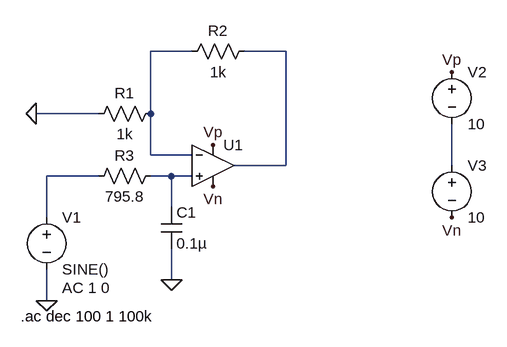
[diagram p0: schematic LPF Using 2KHz CutOFF.asc]
LPF Using 2KHz CutOFF.asc, the LTspice schematic file:
Version 4
SHEET 1 880 680
WIRE 144 -48 80 -48
WIRE 288 -48 224 -48
WIRE 0 48 -96 48
WIRE 80 48 80 -48
WIRE 80 112 80 48
WIRE 144 112 80 112
WIRE 288 128 288 -48
WIRE 288 128 208 128
WIRE 544 128 544 64
WIRE 0 144 -80 144
WIRE 112 144 80 144
WIRE 144 144 112 144
WIRE 112 192 112 144
WIRE -80 208 -80 144
WIRE 112 304 112 256
WIRE -80 336 -80 288
FLAG -80 336 0
FLAG -96 48 0
FLAG 112 304 0
FLAG 544 -16 Vp
FLAG 176 96 Vp
FLAG 544 208 Vn
FLAG 176 160 Vn
SYMBOL OpAmps\\UniversalOpAmp 176 128 R0
SYMATTR InstName U1
SYMBOL res 96 32 R90
WINDOW 0 0 56 VBottom 2
WINDOW 3 32 56 VTop 2
SYMATTR InstName R1
SYMATTR Value 1k
SYMBOL res 240 -64 R90
WINDOW 0 0 56 VBottom 2
WINDOW 3 32 56 VTop 2
SYMATTR InstName R2
SYMATTR Value 1k
SYMBOL res 96 128 R90
WINDOW 0 0 56 VBottom 2
WINDOW 3 32 56 VTop 2
SYMATTR InstName R3
SYMATTR Value 795.8
SYMBOL voltage -80 192 R0
WINDOW 123 24 124 Left 2
WINDOW 39 0 0 Left 0
SYMATTR Value2 AC 1 0
SYMATTR InstName V1
SYMATTR Value SINE()
SYMBOL voltage 544 -32 R0
SYMATTR InstName V2
SYMATTR Value 10
SYMBOL voltage 544 112 R0
WINDOW 123 0 0 Left 0
WINDOW 39 0 0 Left 0
SYMATTR InstName V3
SYMATTR Value 10
SYMBOL cap 96 192 R0
SYMATTR InstName C1
SYMATTR Value 0.1µ
TEXT -120 360 Left 2 !.ac dec 100 1 100k

The netlist it stands for:
* LPF Using 2KHz CutOFF.asc
XU1 N005 N001 Vp Vn N002 level1 Avol=1Meg GBW=10Meg Vos=0 En=0 Enk=0 In=0 Ink=0 Rin=500Meg  ; pins In+ In- V+ V- OUT
R1 N001 0 1k
R2 N002 N001 1k
R3 N005 N004 795.8
V1 N004 0 SINE() AC 1 0
V2 Vp N003 10
V3 N003 Vn 10
C1 N005 0 0.1µ
.ac dec 100 1 100k
.lib UniversalOpAmp1.lib
.backanno
.end